# Altium schematic sheet FE.SchDoc: ThunderScope 1000E
size A4; Revision: 1; SheetNumber: 3; SheetTotal: 14
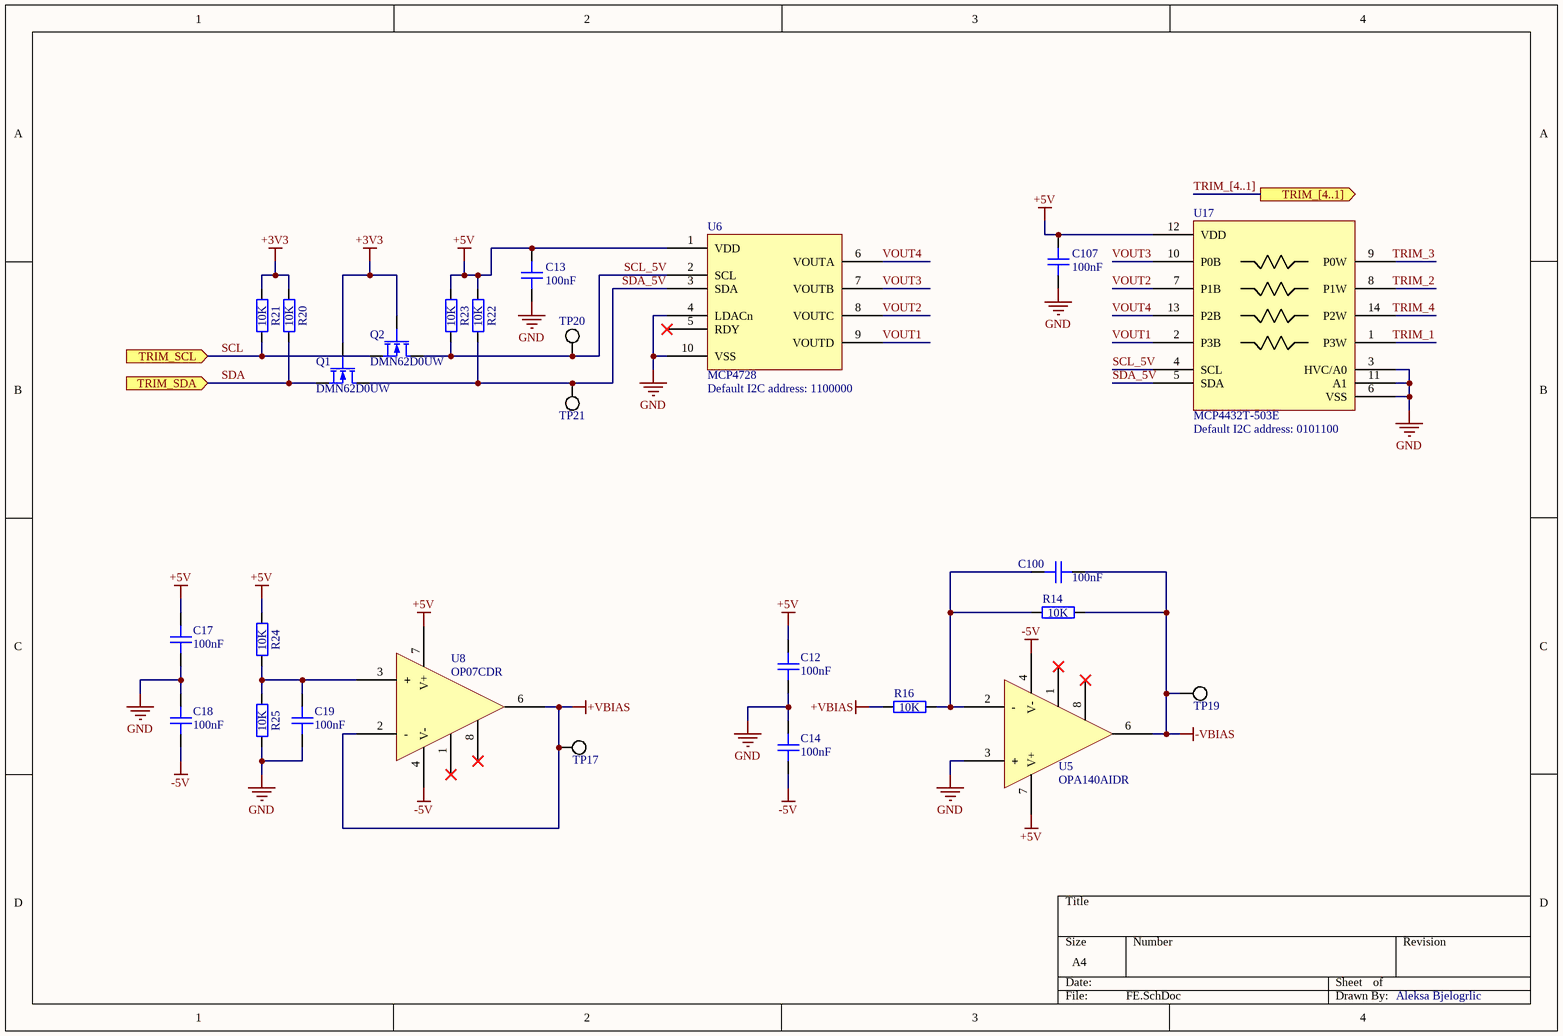
[diagram p0: FE.SchDoc]

## Parts
C12  100nF  [GEN_C_0402]
C13  100nF  [GEN_C_0402]
C14  100nF  [GEN_C_0402]
C17  100nF  [GEN_C_0402]
C18  100nF  [GEN_C_0402]
C19  100nF  [GEN_C_0402]
C100  100nF  [GEN_C_0402]
C107  100nF  [GEN_C_0402]
Q1  DMN62D0UW  [GEN_SOT_323]
Q2  DMN62D0UW  [GEN_SOT_323]
R14  10K  [GEN_R_0402]
R16  10K  [GEN_R_0402]
R20  10K  [GEN_R_0402]
R21  10K  [GEN_R_0402]
R22  10K  [GEN_R_0402]
R23  10K  [GEN_R_0402]
R24  10K  [GEN_R_0402]
R25  10K  [GEN_R_0402]
TP17  PCB  [GEN_TP_PCB]  (value not drawn)  (no BOM)
TP19  PCB  [GEN_TP_PCB]  (value not drawn)  (no BOM)
TP20  PCB  [GEN_TP_PCB]  (value not drawn)  (no BOM)
TP21  PCB  [GEN_TP_PCB]  (value not drawn)  (no BOM)
U5  OPA140AIDR  [TI_SOIC8_D0008A]
U6  MCP4728  [MC_MSOP10_UN]
U8  OP07CDR  [TI_SOIC8_D0008A]
U17  MCP4432T-503E  [MC_TSSOP14]

## Ports
TRIM_[4..1] (out), TRIM_SCL (in), TRIM_SDA (in)

## Nets
+3V3: Q1.2(G) Q2.2(G) R20.2 R21.2
+5V: C12.1 C13.2 C17.1 C107.2 R22.2 R23.2 R24.2 U5.7(V+) U6.1(VDD) U8.7(V+) U17.12(VDD)
+VBIAS: R16.1 TP17.1 U8.2(-) U8.6(OUT)
-5V: C14.2 C18.2 U5.4(V-) U8.4(V-)
-VBIAS: C100.1 R14.2 TP19.1 U5.6(OUT)
GND: C12.2 C13.1 C14.1 C17.2 C18.1 C19.1 C107.1 R25.1 U5.3(+) U6.4(LDACn) U6.10(VSS) U17.3(HVC/A0) U17.6(VSS) U17.11(A1)
SCL: Q2.3(S) R21.1 ; port TRIM_SCL
SCL_5V: Q2.1(D) R23.1 TP20.1 U6.2(SCL) U17.4(SCL)
SDA: Q1.3(S) R20.1 ; port TRIM_SDA
SDA_5V: Q1.1(D) R22.1 TP21.1 U6.3(SDA) U17.5(SDA)
TRIM_1: U17.1(P3W)
TRIM_2: U17.8(P1W)
TRIM_3: U17.9(P0W)
TRIM_4: U17.14(P2W)
VOUT1: U6.9(VOUTD) U17.2(P3B)
VOUT2: U6.8(VOUTC) U17.7(P1B)
VOUT3: U6.7(VOUTB) U17.10(P0B)
VOUT4: U6.6(VOUTA) U17.13(P2B)
NetC19_2: C19.2 R24.1 R25.2 U8.3(+)
NetC100_2: C100.2 R14.1 R16.2 U5.2(-)

Not connected (* = marked no-connect by the designer): U5 1(N1)* 8(N2)*; U6 5(RDY)*; U8 1(N1)* 8(N2)*

## Buses and harness runs
bus TRIM_[4..1] = port TRIM_[4..1]

## Notes on the sheet
- (near U6) Default I2C address: 1100000
- (near U17) Default I2C address: 0101100
- Aleksa Bjelogrlic

## Library data of the parts
C12-C14 C17-C19 C100 C107 = CAP 100nF 16V X7R 0402: House Part Number: C-100nF-0402-002; Manufacturer: Murata; Manufacturer Part Number: GCM155R71C104KA55D; Voltage Rating: 16V; Package: 0402; Supplier 1: Mouser; Supplier Part Number 1: 81-GCM155R71C104KA5D; Value: 100nF
Q1 Q2 = NMOS DMN62D0UW: House Part Number: DMN62D0UW-7; Manufacturer: Diodes; Vdss: 60V; Supplier 1: Mouser; Supplier Part Number 1: 621-DMN62D0UW-7; Manufacturer Part Number: DMN62D0UW-7
R14 R16 R20-R25 = RES 10K OHM 1% 1/10W 0402: Manufacturer: Panasonic; Manufacturer Part Number: ERJ-2RKF1002X; Tolerance: 1%; Package: 0402; Supplier 1: Mouser; Supplier Part Number 1: 667-ERJ-2RKF1002X; Value: 10K
TP17 TP19-TP21 = TP PCB 1mm
U5 = IC OPAMP OPA140: Manufacturer: Texas Instruments; Supplier 1: Texas Instruments; Supplier Part Number 1: OPA140AIDR; Manufacturer Part Number: OPA140AIDR
U6 = IC DAC QUAD MCP4728: Manufacturer: Microchip; Supplier 1: Mouser; Supplier Part Number 1: 579-MCP4728A1T-E/UN; Manufacturer Part Number: MCP4728
U8 = IC OPAMP OP07CDR: Manufacturer: Texas Instruments; Supplier 1: Texas Instruments; Supplier Part Number 1: OP07CDR; Manufacturer Part Number: OP07CDR
U17 = IC DIGIPOT QUAD MCP4432T-503E: Manufacturer: Microchip; Manufacturer Part Number: MCP4432T-503E/ST; Supplier 1: Mouser; Supplier Part Number 1: 579-MCP4432-503E/ST